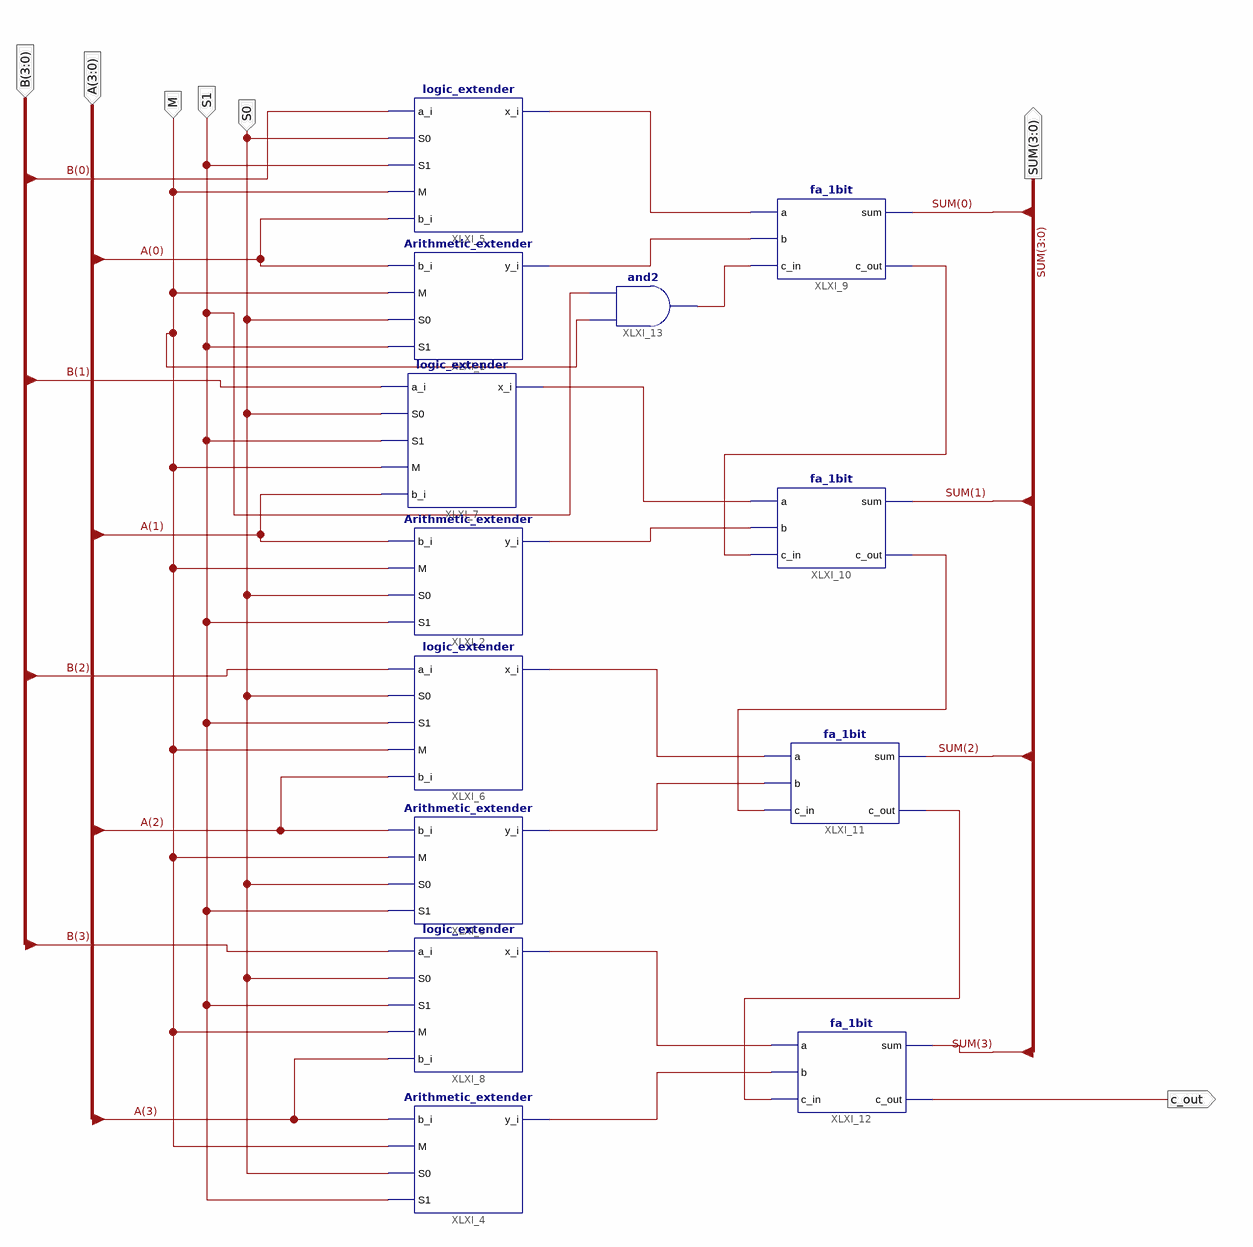
[diagram p0: schematic sheet 1]
// Xilinx ISE schematic alu_lab_instructions.sch (spartan3e) as structural Verilog: 13 symbols, 7 ports
module alu_lab_instructions (
  input  [3:0] B,
  input  [3:0] A,
  input  M,
  input  S1,
  input  S0,
  output c_out,
  output [3:0] SUM
);

  wire XLXN_19, XLXN_20, XLXN_21, XLXN_22, XLXN_23, XLXN_25, XLXN_26, XLXN_27, XLXN_28, XLXN_29, XLXN_30,
       XLXN_35;

  Arithmetic_extender XLXI_1 (.b_i(A[0]), .M(M), .S0(S0), .S1(S1), .y_i(XLXN_20));
  Arithmetic_extender XLXI_2 (.b_i(A[1]), .M(M), .S0(S0), .S1(S1), .y_i(XLXN_23));
  Arithmetic_extender XLXI_3 (.b_i(A[2]), .M(M), .S0(S0), .S1(S1), .y_i(XLXN_26));
  Arithmetic_extender XLXI_4 (.b_i(A[3]), .M(M), .S0(S0), .S1(S1), .y_i(XLXN_28));
  logic_extender XLXI_5 (.a_i(B[0]), .S0(S0), .S1(S1), .M(M), .b_i(A[0]), .x_i(XLXN_19));
  logic_extender XLXI_6 (.a_i(B[2]), .S0(S0), .S1(S1), .M(M), .b_i(A[2]), .x_i(XLXN_25));
  logic_extender XLXI_7 (.a_i(B[1]), .S0(S0), .S1(S1), .M(M), .b_i(A[1]), .x_i(XLXN_22));
  logic_extender XLXI_8 (.a_i(B[3]), .S0(S0), .S1(S1), .M(M), .b_i(A[3]), .x_i(XLXN_27));
  fa_1bit XLXI_9 (.a(XLXN_19), .b(XLXN_20), .c_in(XLXN_35), .sum(SUM[0]), .c_out(XLXN_21));
  fa_1bit XLXI_10 (.a(XLXN_22), .b(XLXN_23), .c_in(XLXN_21), .sum(SUM[1]), .c_out(XLXN_30));
  fa_1bit XLXI_11 (.a(XLXN_25), .b(XLXN_26), .c_in(XLXN_30), .sum(SUM[2]), .c_out(XLXN_29));
  fa_1bit XLXI_12 (.a(XLXN_27), .b(XLXN_28), .c_in(XLXN_29), .sum(SUM[3]), .c_out(c_out));
  and XLXI_13 (XLXN_35, M, S1);
endmodule
